# Altium schematic sheet JHDrivesheet2.SchDoc
size A4; SheetNumber: 2; SheetTotal: 2
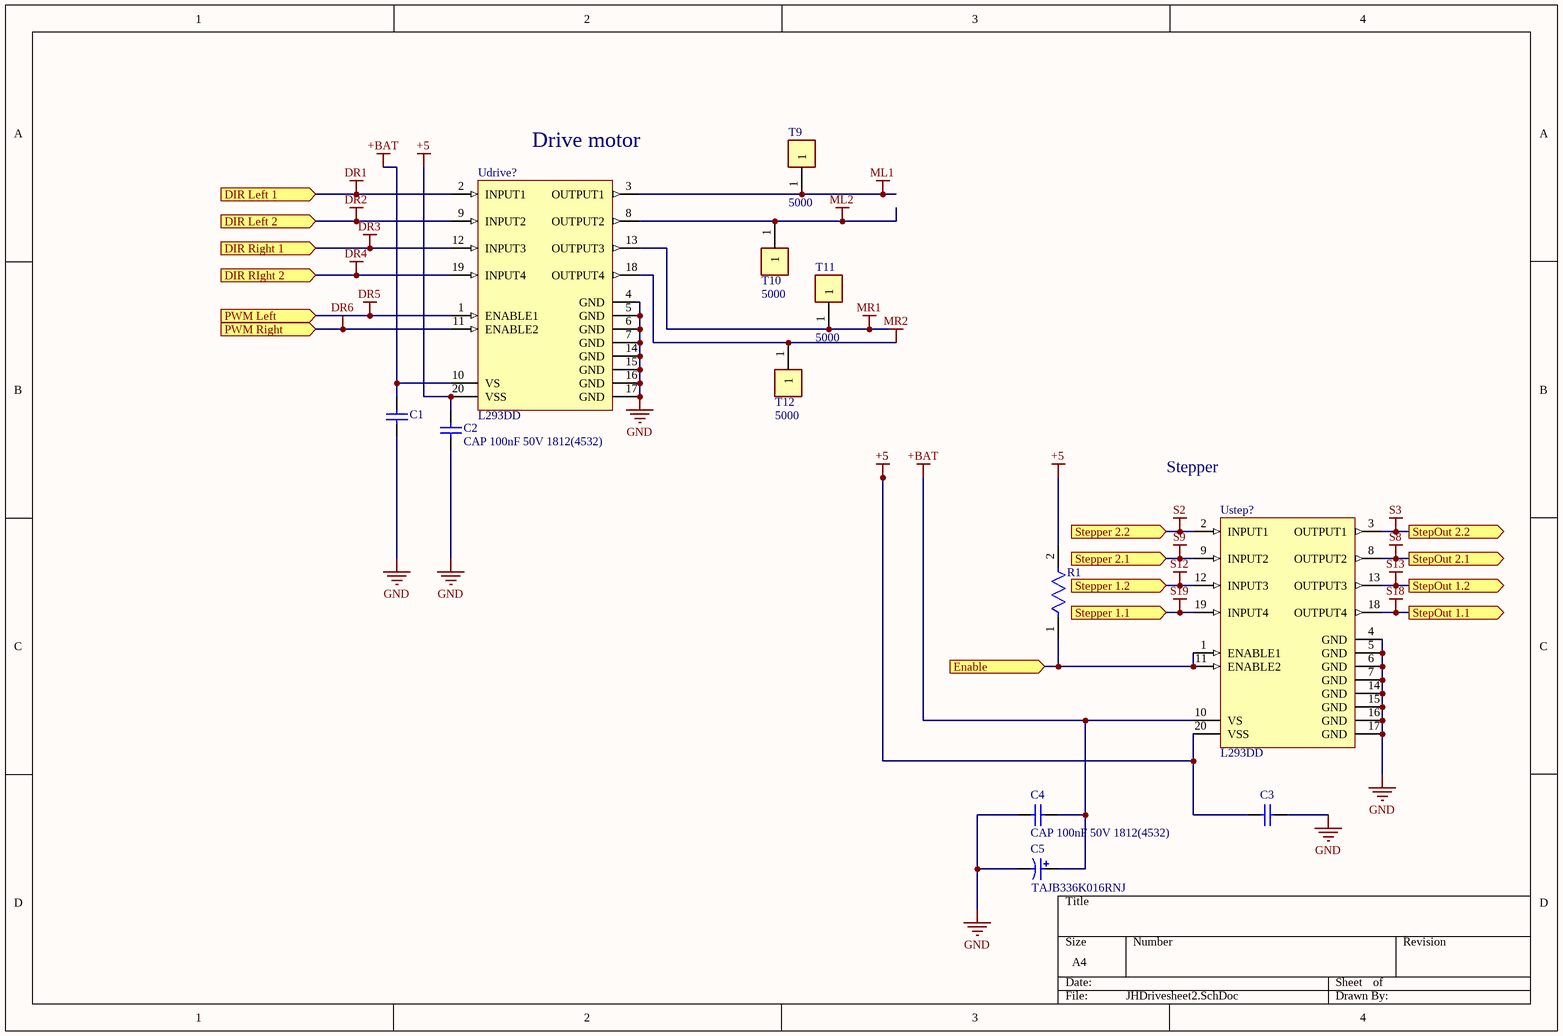
[diagram p0: JHDrivesheet2.SchDoc]

## Parts
C1  C333C105M5U5TA  [KEMT-C333C105M5U5TA-2]  (value not drawn)
C2  CAP 100nF 50V 1812(4532)  [CAPC1812(4532)100_M]
C3  CAP 100nF 50V 1812(4532)  [CAPC1812(4532)100_M]  (value not drawn)
C4  CAP 100nF 50V 1812(4532)  [CAPC1812(4532)100_M]
C5  TAJB336K016RNJ  [CAPMP3529X21-T_V]
R1  CR2010-JW-103ELF  [FP-CR2010-IPC_C]  (value not drawn)
T9  5000  [FP-5000-MFG]
T10  5000  [FP-5000-MFG]
T11  5000  [FP-5000-MFG]
T12  5000  [FP-5000-MFG]
Udrive?  L293DD  [STM-SOIC-20_M]
Ustep?  L293DD  [STM-SOIC-20_M]

## Ports
DIR Left 1 (in), DIR Left 2 (in), DIR Right 1 (in), DIR RIght 2 (in), Enable (in), PWM Left (in), PWM Right (in), StepOut 1.1 (out), StepOut 1.2 (out), StepOut 2.1 (out), StepOut 2.2 (out), Stepper 1.1 (in), Stepper 1.2 (in), Stepper 2.1 (in), Stepper 2.2 (in)

## Nets
+5: C2.2 C3.1 R1.2 Udrive?.20(VSS) Ustep?.20(VSS)
+BAT: C1.2 C4.2 C5.1 Udrive?.10(VS) Ustep?.10(VS)
DR1: Udrive?.2(INPUT1) ; port DIR Left 1
DR2: Udrive?.9(INPUT2) ; port DIR Left 2
DR3: Udrive?.12(INPUT3) ; port DIR Right 1
DR4: Udrive?.19(INPUT4) ; port DIR RIght 2
DR5: Udrive?.1(ENABLE1) ; port PWM Left
DR6: Udrive?.11(ENABLE2) ; port PWM Right
GND: C1.1 C2.1 C3.2 C4.1 C5.2 Udrive?.4(GND) Udrive?.5(GND) Udrive?.6(GND) Udrive?.7(GND) Udrive?.14(GND) Udrive?.15(GND) Udrive?.16(GND) Udrive?.17(GND) Ustep?.4(GND) Ustep?.5(GND) Ustep?.6(GND) Ustep?.7(GND) Ustep?.14(GND) Ustep?.15(GND) Ustep?.16(GND) Ustep?.17(GND)
ML1: T9.1 Udrive?.3(OUTPUT1)
ML2: T10.1 Udrive?.8(OUTPUT2)
MR1: T11.1 Udrive?.13(OUTPUT3)
MR2: T12.1 Udrive?.18(OUTPUT4)
S2: Ustep?.2(INPUT1) ; port Stepper 2.2
S3: Ustep?.3(OUTPUT1) ; port StepOut 2.2
S8: Ustep?.8(OUTPUT2) ; port StepOut 2.1
S9: Ustep?.9(INPUT2) ; port Stepper 2.1
S12: Ustep?.12(INPUT3) ; port Stepper 1.2
S13: Ustep?.13(OUTPUT3) ; port StepOut 1.2
S18: Ustep?.18(OUTPUT4) ; port StepOut 1.1
S19: Ustep?.19(INPUT4) ; port Stepper 1.1
Enable: R1.1 Ustep?.1(ENABLE1) Ustep?.11(ENABLE2) ; port Enable

## Notes on the sheet
- (near Udrive?) Drive motor
- Stepper

## Library data of the parts
C1 = CMP-2000-05174-1: Multilayer Ceramic Capacitor / Axial and Radial Leaded, 1 uF, +/- 20%, 10 to 85 degC, 2-Pin THD, RoHS, Bulk; Manufacturer: Kemet; Voltage Rating: 50V; Temperature Coefficient / Code: Z5U; Case Height: 3.81mm; Lead Diameter: 0.51mm; Case Style: ConformallyCoated; Dissipation Factor DF: 4; Capacitance: 1uF; Case Length: 9.91mm; Type: RadialLeads; Case Width: 7.62mm; Dimensions: 7.62mmWx9.91mmLx3.81mmH; Termination Style: Radial; Factory Pack Quantity: 250; Packaging: Bulk; RoHS: Details; Datasheet Version: Jul-09; Lead Spacing: 5.08mm; Product Category: MultilayerCeramicCapacitorsMLCC-Leaded; Maximum Operating Temperature: +125C; Product: GeneralTypeMLCCs; Manufacturer URL: http://www.kemet.com/; Lead Style: InsideBend; Operating Temperature Range: -55Cto+125C; Datasheet URL: http://www.farnell.com/datasheets/706880.pdf; Voltage Rating DC: 50V; Brand: Kemet; Series: C333; Tolerance: 20%; Minimum Operating Temperature: -55C
C2-C4 = CMP-1040-01293-1: CAP 100nF 50V ±20% 1812 (4532 Metric) Thickness 1mm SMD; Case-Metric: 4532; Tolerance: Â±20%; Case-EIA: 1812; Rated Voltage: 50 V; Value: 100nF; Max Thickness: 1 mm; Technology: SMT
C5 = CMP-2000-07224-1: Standard Tantalum, 33 uF, +/- 10%, 16 V, -55 to 125 degC, 2-Pin SMD, RoHS, Tape and Reel; Manufacturer: AVX; Manufacturer Size Code: B; PCN Part Number: TAJSeriesSuffix08/Dec/2008; Other Names: 478-1688-1; Kits: 478-3443-ND-KITTANTCAPTAJSERIES; Product Training Modules: ComponentSolutionsforSmartMeterApplications; Catalog Drawings: TAJSeriesSideTAJSeries; ESR (Equivalent Series Resistance): 2.1Ohm; EDA / CAD Models: DownloadfromAcceleratedDesigns; Capacitance: 33µF; Voltage - Rated: 16V; Type: Molded; Online Catalog: TAJSeries; Lead Spacing: -; Family: TantalumCapacitors; Series: TAJ; Package Reference: CAPMP3529X21-T; Package / Case: 1210(3528Metric); Category: Capacitors; Packaging: CutTape(CT); Lifetime @ Temp.: -; Package URL: http://www.avx.com/download/software/literature/AVX-Footprint-Library.pdf; Tolerance: ±10%; Manufacturer URL: http://www.avx.com/; Package Description: 2-Pin Surface Mount Device, Body 3.5 x 2.85 mm; Features: GeneralPurpose; Height - Seated (Max): 0.083"(2.10mm); Mounting Technology: SurfaceMount; Datasheet Version: 02/2016; Datasheet URL: http://datasheets.avx.com/TAJ.pdf; Operating Temperature: -55°C~125°C; Standard Package: 1; Size / Dimension: 0.138"Lx0.110"W(3.50mmx2.80mm); Mounting Type: SurfaceMount
R1 = CMP-07231-003456-1: Thick Film Chip Resistors 2010 10kΩ 0.5W 5% 200ppm/°C; Resistance: 10kR; Voltage Rating: 200V; Power Rating: 500mW; Tolerance: 5%; Contact Plating: Tin; Length: 5mm; Case/Package: 2010; Package Quantity: 4000; Max Operating Temperature: 155°C; Case Code (Imperial): 2010; Mount: Surface Mount; Case Code (Metric): 5025; Width: 2.5mm; Temperature Coefficient: 200ppm/°C; Packaging: Tape and Reel; Height: 0.6mm; Radiation Hardening: No; Composition: Thick Film; Min Operating Temperature: -55°C; Termination: SMD/SMT
T9-T12 = CMP-19636-000027-1: PC TEST POINT MINIATURE RED; Outside Diameter: 2.54mm; Body Material: Bronze; Number of Contacts: 1; Insulation: Insulated; Inside Diameter: 1.27mm; Hole Diameter: 1.6mm; Plating: Silver; Material: Nylon; Length: 7.62mm; Package Quantity: 100; Number of Ports: 1; Contact Material: Bronze; Orientation: Straight; RoHS Compliant: Yes; Housing Color: Red; Height: 0.3inch; Series: THM; Lead Free: Lead Free; Color: Red; Contact Plating: Tin; Mount: PCB; Packaging: Bulk; REACH SVHC: No SVHC; Flammability Rating: UL94 V-0
Udrive? Ustep? = CMP-1771-00003-1: Push-Pull Four Channel Driver with Diodes, 4.5 to 36 V, 20-Pin SOIC, RoHS, Tube; Voltage Rating: 50 V; Power Rating: 100 mW; Case\Package: 0603; Resistance: 15 kohm; Tolerance: 1%; REACH SVHC: Unknown; Case Code (Imperial): 0603; ComponentLink2Description: Datasheet; ComponentLink2URL: http://www.st.com/content/ccc/resource/technical/document/datasheet/04/ac/22/f9/20/5d/43/a1/CD00000059.pdf/files/CD00000059.pdf/jcr:content/translations/en.CD00000059.pdf; Max Operating Temperature: 155 degC; Width: 0.8 mm; ComponentLink1URL: http://www.st.com/; ComponentLink1Description: Manufacturer URL; Length: 1.6 mm; Package Quantity: 5000; RoHSCompliant: true; Height: 0.45 mm; Mount: Surface Mount; PackageDescription: 20-Pin Small Outline Integrated Circuit, Body 12.8 x 7.5 mm, Pitch 1.27 mm; PackageReference: SOIC-20; Packaging: Tape and Reel; Min Operating Temperature: -55 degC; Case Code (Metric): 1608; DatasheetVersion: Jul-03